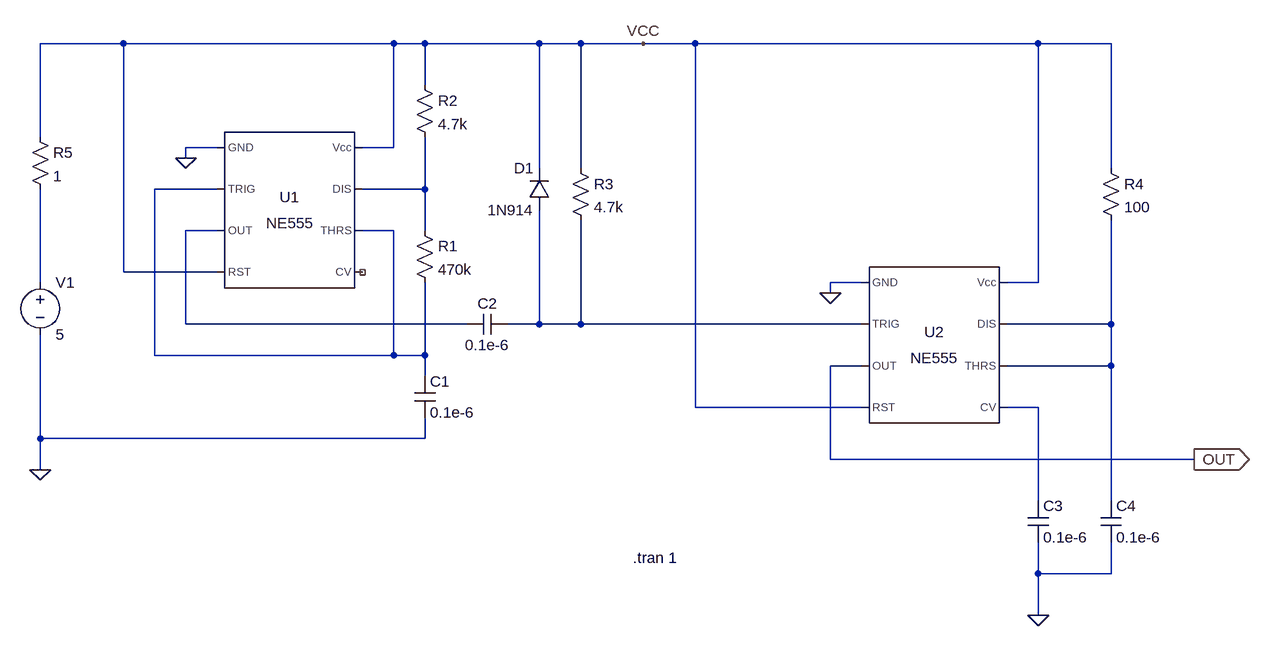
[diagram p0: schematic garagelights.asc]
garagelights.asc, the LTspice schematic file:
Version 4.1
SHEET 1 1516 1012
WIRE -240 -80 -368 -80
WIRE 176 -80 -240 -80
WIRE 224 -80 176 -80
WIRE 400 -80 224 -80
WIRE 464 -80 400 -80
WIRE 560 -80 464 -80
WIRE 640 -80 560 -80
WIRE 1168 -80 640 -80
WIRE 1280 -80 1168 -80
WIRE 224 -16 224 -80
WIRE -368 64 -368 -80
WIRE -96 80 -144 80
WIRE 176 80 176 -80
WIRE 176 80 128 80
WIRE -144 96 -144 80
WIRE 400 112 400 -80
WIRE 464 112 464 -80
WIRE 1280 112 1280 -80
WIRE -96 144 -192 144
WIRE 224 144 224 64
WIRE 224 144 128 144
WIRE -96 208 -144 208
WIRE 176 208 128 208
WIRE 224 208 224 144
WIRE -240 272 -240 -80
WIRE -96 272 -240 272
WIRE -368 288 -368 144
WIRE 896 288 848 288
WIRE 1168 288 1168 -80
WIRE 1168 288 1120 288
WIRE 848 304 848 288
WIRE -144 352 -144 208
WIRE 288 352 -144 352
WIRE 400 352 400 176
WIRE 400 352 352 352
WIRE 464 352 464 192
WIRE 464 352 400 352
WIRE 896 352 464 352
WIRE 1280 352 1280 192
WIRE 1280 352 1120 352
WIRE -192 400 -192 144
WIRE 176 400 176 208
WIRE 176 400 -192 400
WIRE 224 400 224 288
WIRE 224 400 176 400
WIRE 896 416 848 416
WIRE 1280 416 1280 352
WIRE 1280 416 1120 416
WIRE 224 432 224 400
WIRE 640 480 640 -80
WIRE 896 480 640 480
WIRE 1168 480 1120 480
WIRE -368 528 -368 368
WIRE 224 528 224 496
WIRE 224 528 -368 528
WIRE 848 560 848 416
WIRE 1408 560 848 560
WIRE -368 576 -368 528
WIRE 1168 624 1168 480
WIRE 1280 624 1280 416
WIRE 1168 736 1168 688
WIRE 1280 736 1280 688
WIRE 1280 736 1168 736
WIRE 1168 800 1168 736
FLAG -368 576 0
FLAG -144 96 0
FLAG 848 304 0
FLAG 1168 800 0
FLAG 1408 560 OUT
IOPIN 1408 560 Out
FLAG 560 -80 VCC
SYMBOL Misc\\NE555 16 176 R0
SYMATTR InstName U1
SYMBOL voltage -368 272 R0
WINDOW 123 0 0 Left 0
WINDOW 39 0 0 Left 0
SYMATTR InstName V1
SYMATTR Value 5
SYMBOL cap 208 432 R0
SYMATTR InstName C1
SYMATTR Value 0.1e-6
SYMBOL res 208 192 R0
SYMATTR InstName R1
SYMATTR Value 470k
SYMBOL res 208 -32 R0
SYMATTR InstName R2
SYMATTR Value 4.7k
SYMBOL cap 352 336 R90
WINDOW 0 0 32 VBottom 2
WINDOW 3 32 32 VTop 2
SYMATTR InstName C2
SYMATTR Value 0.1e-6
SYMBOL res 448 96 R0
SYMATTR InstName R3
SYMATTR Value 4.7k
SYMBOL diode 416 176 R180
WINDOW 0 24 64 Left 2
WINDOW 3 24 0 Left 2
SYMATTR InstName D1
SYMATTR Value 1N914
SYMBOL Misc\\NE555 1008 384 R0
SYMATTR InstName U2
SYMBOL cap 1152 624 R0
SYMATTR InstName C3
SYMATTR Value 0.1e-6
SYMBOL cap 1264 624 R0
SYMATTR InstName C4
SYMATTR Value 0.1e-6
SYMBOL res 1264 96 R0
SYMATTR InstName R4
SYMATTR Value 100
SYMBOL res -384 48 R0
SYMATTR InstName R5
SYMATTR Value 1
TEXT 544 712 Left 2 !.tran 1

The netlist it stands for:
* garagelights.asc
X§U1 0 N001 N003 VCC NC_01 N001 N002 VCC NE555  ; pins GND TRIG OUT RST CV THRS DIS Vcc
V1 N004 0 5
C1 N001 0 0.1e-6
R1 N002 N001 470k
R2 VCC N002 4.7k
C2 N005 N003 0.1e-6
R3 VCC N005 4.7k
D1 N005 VCC 1N914
X§U2 0 N005 OUT VCC N007 N006 N006 VCC NE555  ; pins GND TRIG OUT RST CV THRS DIS Vcc
C3 N007 0 0.1e-6
C4 N006 0 0.1e-6
R4 VCC N006 100
R5 VCC N004 1
.model D D
.lib standard.dio
.tran 1
.lib NE555.sub
.backanno
.end